# EAGLE design ai_breakout_stereojack (EAGLE 7.1.0)
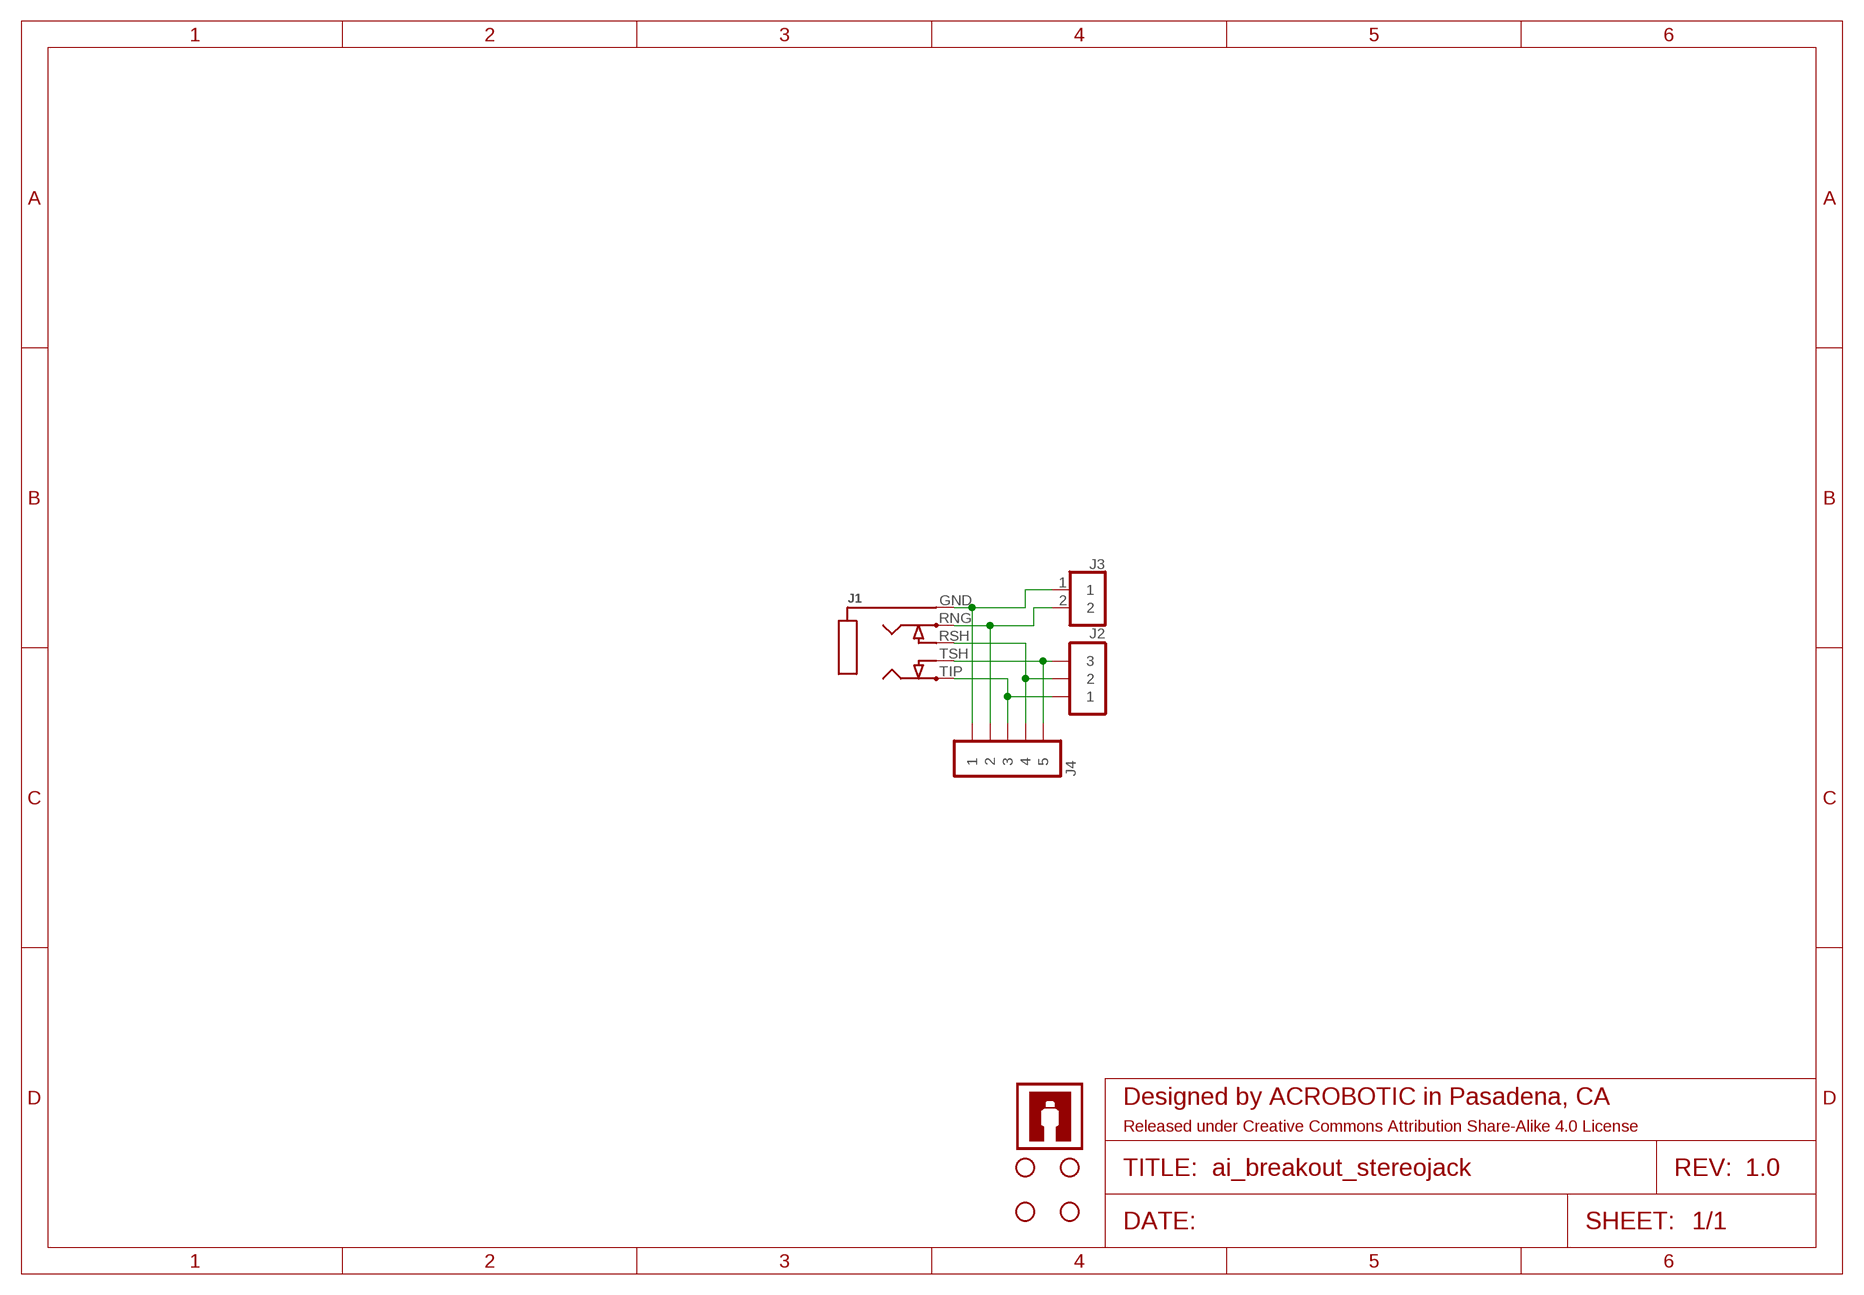
[diagram p0: schematic, sheet 1]

## Parts
FRAME1  FRAME-LETTER  [CREATIVE-COMMONS]
J1  STEREOJACKSJ1-351XNG  [SJ1-351XNG]
J2  1X03ST  [1X03-ST]
J3  1X02ST  [1X02-ST]
J4  1X05  [1X05]
STANDOFF1  STAND-OFF4  [STAND-OFF-4]
STANDOFF2  STAND-OFF4  [STAND-OFF-4]
STANDOFF3  STAND-OFF4  [STAND-OFF-4]
STANDOFF4  STAND-OFF4  [STAND-OFF-4]
U$1  AI-LOGOXS  [AI-LOGO-XS]
U$2  AI-LOGOXS  [AI-LOGO-XS]

## Nets
GND: J1.GND J3.1 J4.1
RNG: J1.RNG J3.2 J4.2
RSH: J1.RSH J2.2 J4.4
TIP: J1.TIP J2.1 J4.3
TSH: J1.TSH J2.3 J4.5

## Library data of the parts
FRAME1 = Ai_Miscellany:FRAME-LETTER: Schematic Frame A4 (8.5x11) US Letter frame based on the built-in A4-LOC frame.; REV: 1.0
J1 = Ai_Connectors:STEREOJACK: MIC/HEADPHONE JACK Stereo jack with two switches. Kycon STX3100, CUI SJ1-3555NG and/or 4UCon 05544
J2 = Ai_Connectors:1X03
J3 = Ai_Connectors:1X02
J4 = Ai_Connectors:1X05
STANDOFF1-STANDOFF4 = Ai_Electromechanical:STAND-OFF: Size #4
U$1 U$2 = Ai_Miscellany:AI-LOGO

## Board
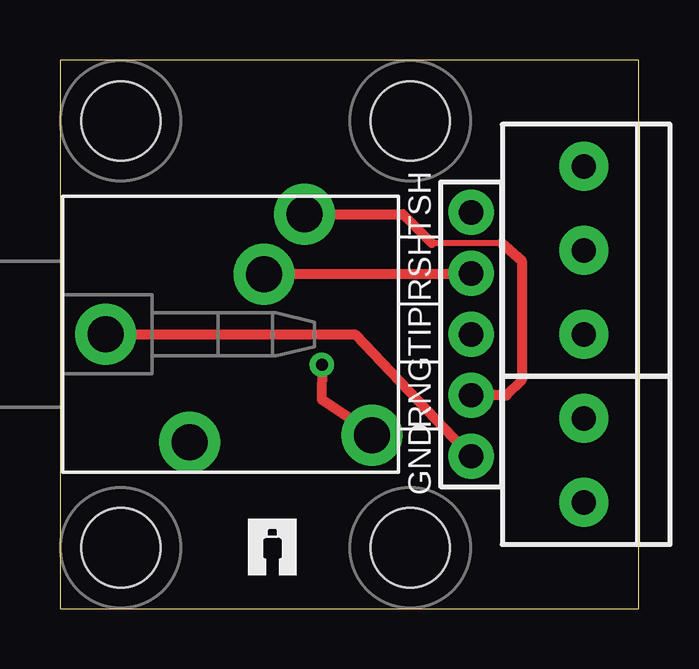
[diagram p1: board, top side]
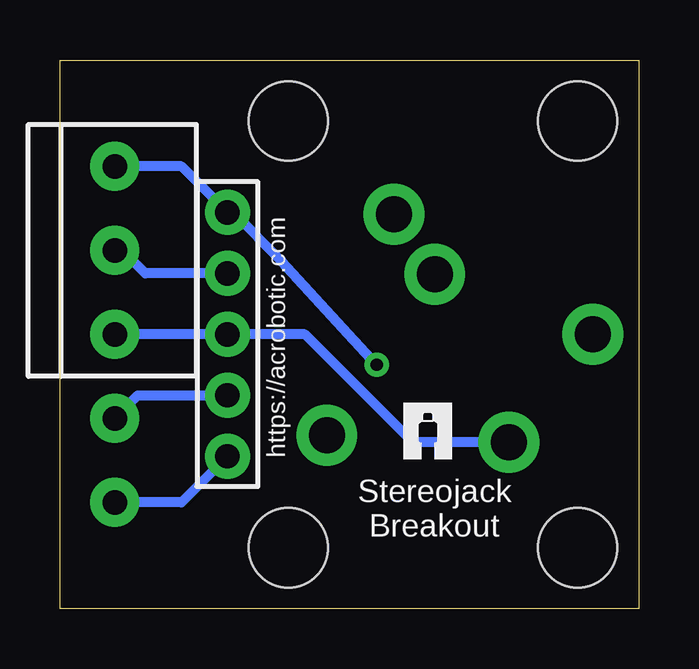
[diagram p2: board, bottom side, seen from below]

Size 24.13 x 22.86 mm. Coordinates in mm from the lower left corner, seen from the top.
Outline: 0,0 24.13,0 24.13,22.86 0,22.86 0,0
Copper layers (1*16): Top 0.035mm / dielectric 1.5mm / Bottom 0.035mm
Design rules "ai_2layer": minimum track width 7mil, minimum drill 15mil, track to track 8mil, track to pad 8mil, pad to pad 8mil, via to via 8mil, smd to smd 8mil, copper to edge 8mil, drill to drill 8mil, minimum pad ring 12mil, minimum via ring 10mil, stop-mask expansion 4mil, vias tented up to drill 20mil, thermal gap 10mil

### Footprints (pad centres in the part's own frame; a part is rotated, then mirrored left to right if it is on the bottom)
SJ1-351XNG = drill 1.5 pad 2.54: GND 0,0; RNG 8.3,5; RSH 6.6,2.5; TIP 3.5,-4.5; TSH 11.1,-4.2
1X03-ST = drill 1.016 pad 2.032: 1 -3.5,0; 2 0,0; 3 3.5,0
1X02-ST = drill 1.016 pad 2.032: 1 -1.75,0; 2 1.75,0
1X05 = drill 1.016 pad 1.88: 1 -5.08,0; 2 -2.54,0; 3 0,0; 4 2.54,0; 5 5.08,0
STAND-OFF-4 = hole 3.302: 0,0

### Placement (x,y rotation side)
FRAME1  10.16,-1.27 0 top
J1  1.91,11.43 0 top
J2  21.84,14.93 90 top
J3  21.84,6.18 90 top
J4  17.14,11.43 90 top
STANDOFF1  14.61,20.32 0 top
STANDOFF2  14.61,2.54 0 top
STANDOFF3  2.54,2.54 0 top
STANDOFF4  2.54,20.32 0 top
U$1  7.87,1.4 0 top
U$2  9.78,6.22 0 bottom

### Tracks (layer width: path | path; a pad name or v marks a point on that pad's centre or on a via)
GND
  Top 0.406: J1.GND 12.32,11.43 J4.1
  Bottom 0.406: J4.1 19.07,4.43 J3.1
RNG
  Top 0.254: 15.49,15.24 18.41,15.24
  Top 0.406: J1.RNG 14.3,16.43 15.49,15.24 | 18.41,15.24 19.25,14.5 19.25,9.53 18.62,8.89 J4.2
  Bottom 0.406: J3.2 20.88,8.89 J4.2
RSH
  Top 0.406: J4.4 17.11,13.93 J1.RSH
  Bottom 0.406: J4.4 20.57,13.97 21.53,14.93 J2.2
TIP
  Bottom 0.406: J4.3 17.65,11.43 | 17.65,11.43 J2.1 | J1.TIP 9.42,6.93 13.92,11.43 17.65,11.43
TSH  (via drill 0.51)
  Top 0.406: J1.TSH 12.19,7.87 10.91,8.72 v10.92,10.16
  Bottom 0.406: v10.92,10.16 14.91,14.5 16.92,16.51 J4.5 19.07,18.43 J2.3

### Text on the board
tPlace: TSH | RSH | TIP | RNG | GND
bPlace: https://acrobotic.com | Stereojack / Breakout
tDocu: @MakerBro